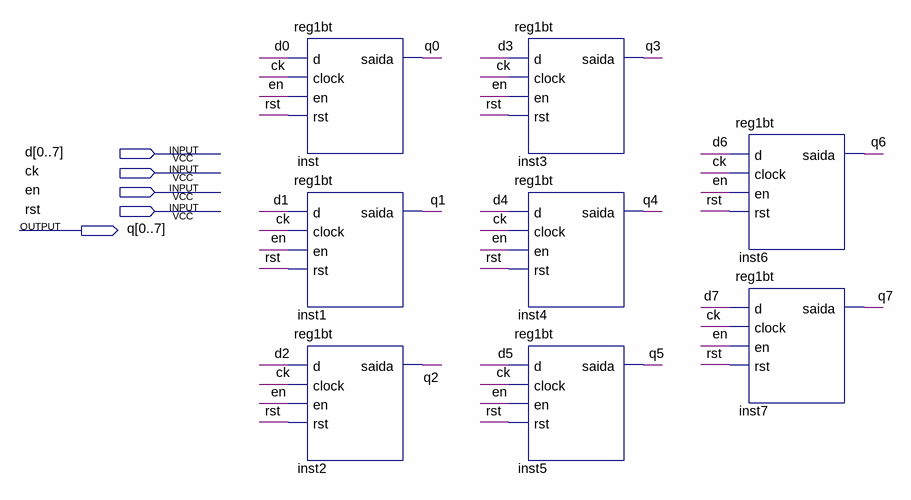
[diagram p0: schematic sheet]
// Quartus schematic reg8bt.bdf as structural Verilog: 8 symbols, 5 pins
module reg8bt (
  input  [0:7] d,
  input  ck,
  input  en,
  input  rst,
  output [0:7] q
);

  reg1bt inst (.d(d[0]), .clock(ck), .en(en), .rst(rst), .saida(q[0]));
  reg1bt inst1 (.d(d[1]), .clock(ck), .en(en), .rst(rst), .saida(q[1]));
  reg1bt inst2 (.d(d[2]), .clock(ck), .en(en), .rst(rst), .saida(q[2]));
  reg1bt inst3 (.d(d[3]), .clock(ck), .en(en), .rst(rst), .saida(q[3]));
  reg1bt inst4 (.d(d[4]), .clock(ck), .en(en), .rst(rst), .saida(q[4]));
  reg1bt inst5 (.d(d[5]), .clock(ck), .en(en), .rst(rst), .saida(q[5]));
  reg1bt inst6 (.d(d[6]), .clock(ck), .en(en), .rst(rst), .saida(q[6]));
  reg1bt inst7 (.d(d[7]), .clock(ck), .en(en), .rst(rst), .saida(q[7]));
endmodule
